# EAGLE design Sifteo Thundercracker Buddy Dev (EAGLE 5.11)
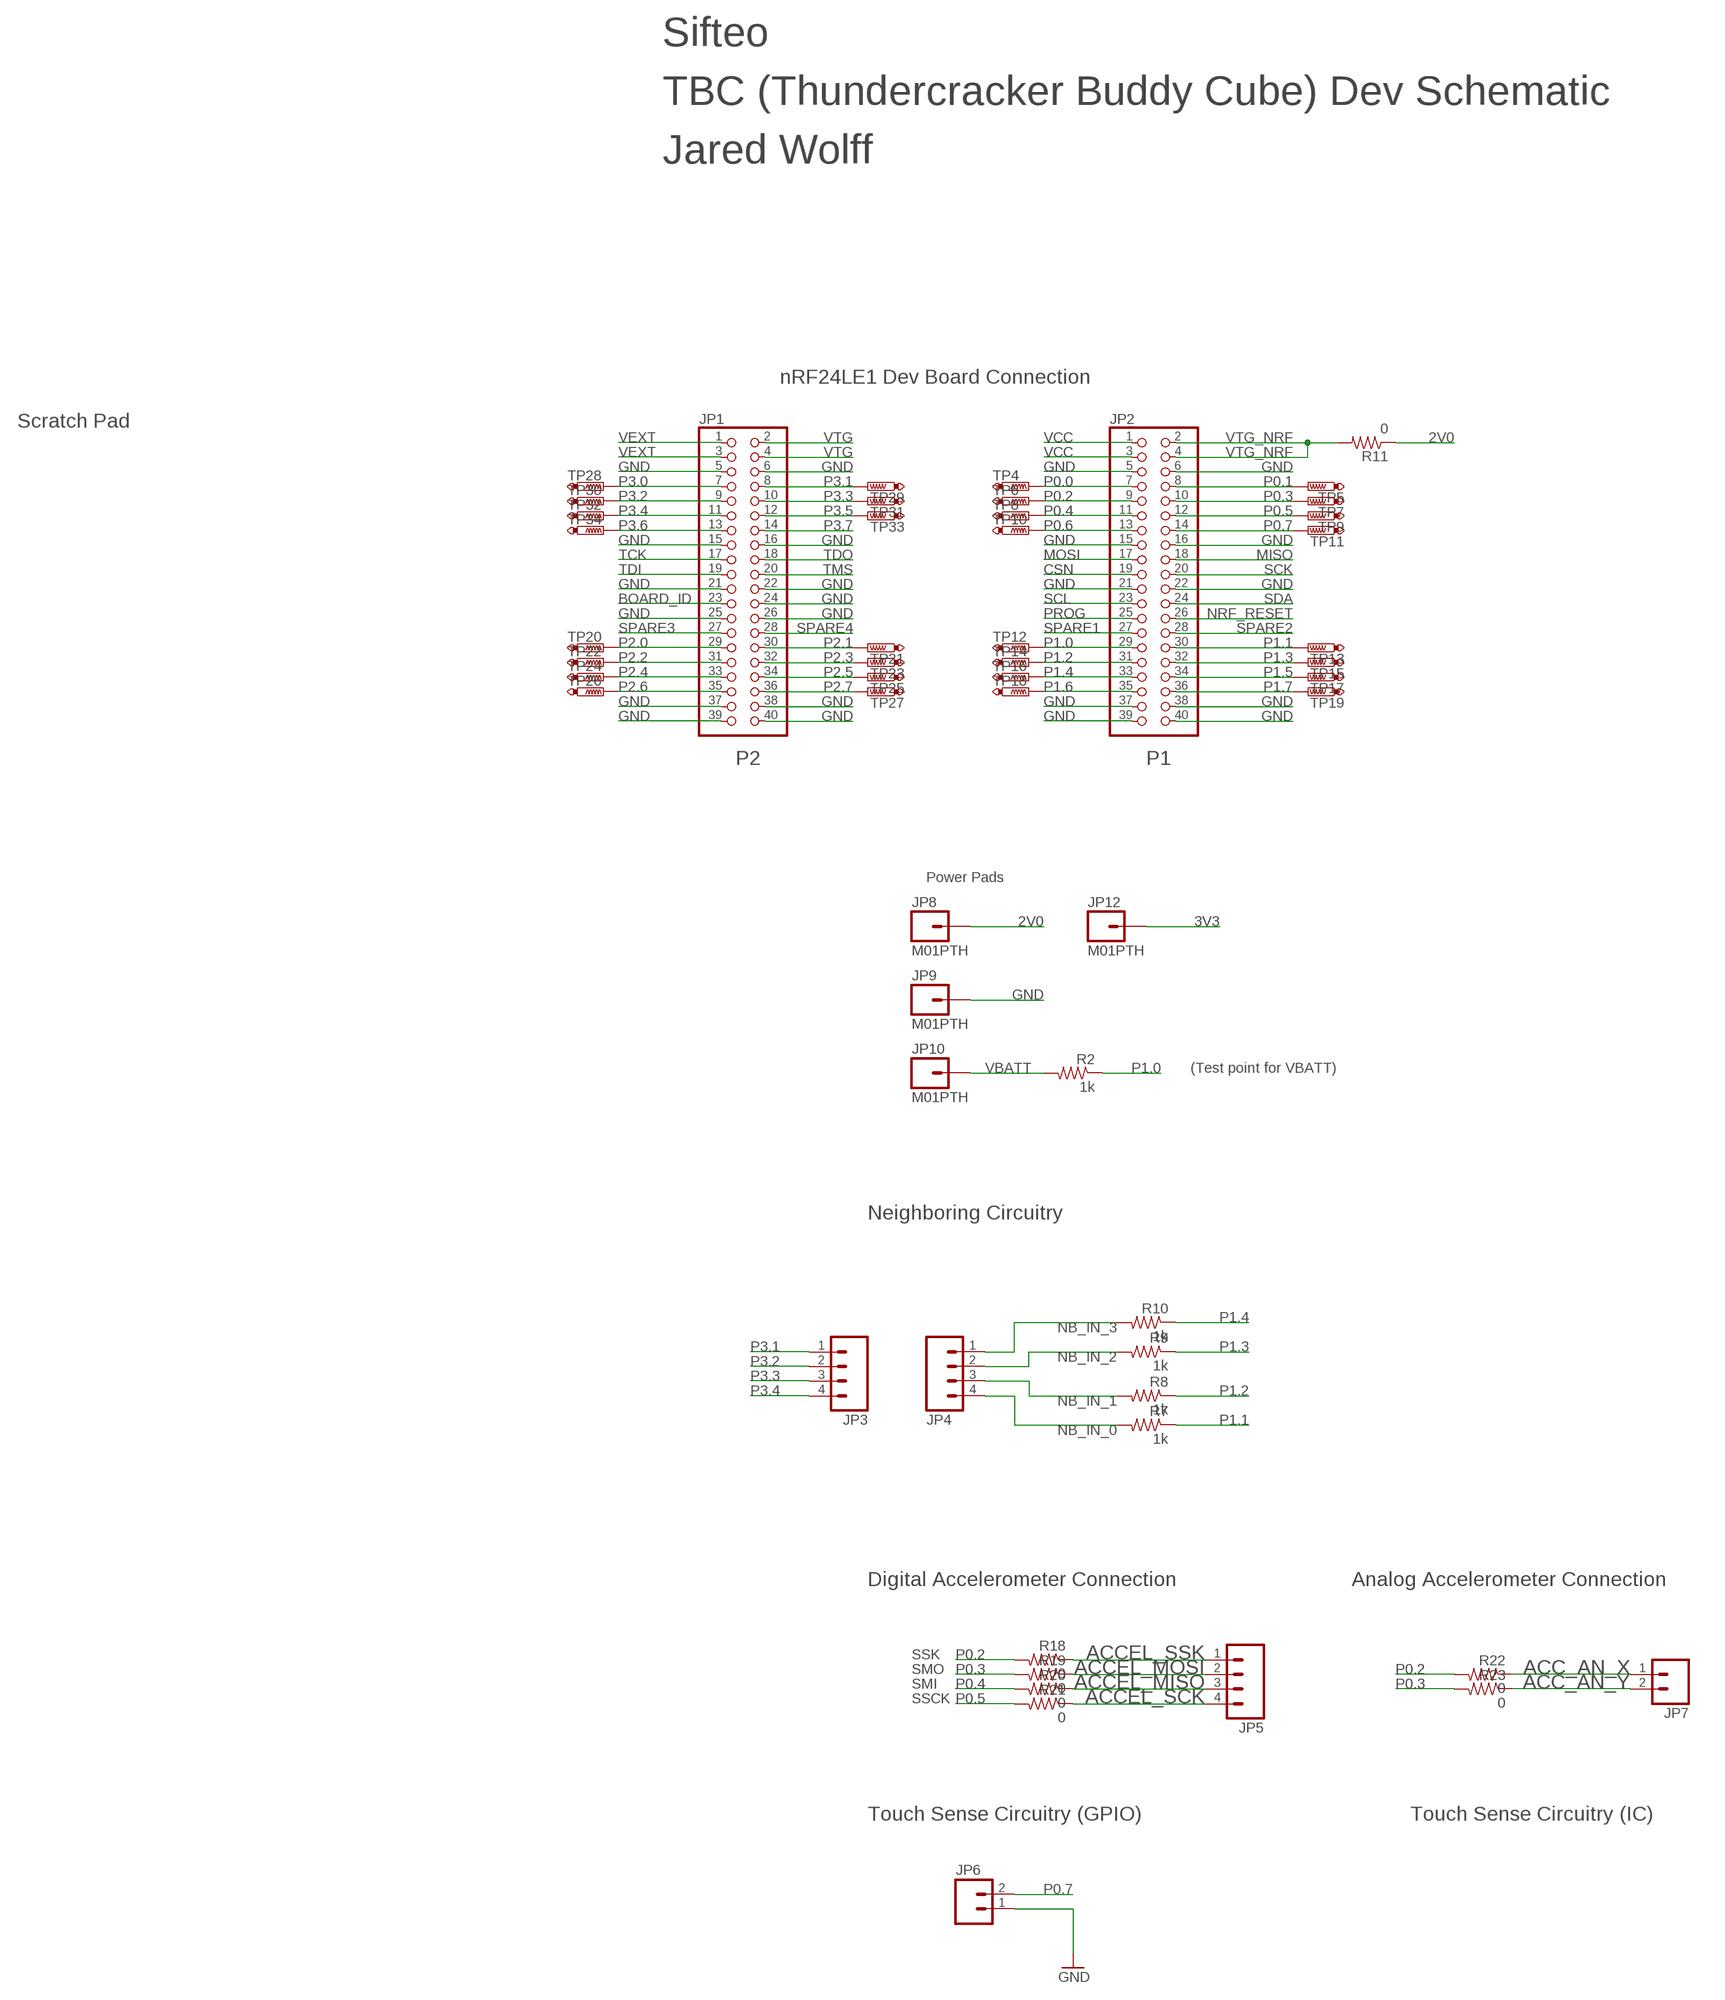
[diagram p0: schematic, sheet 1, part 1 of 2]
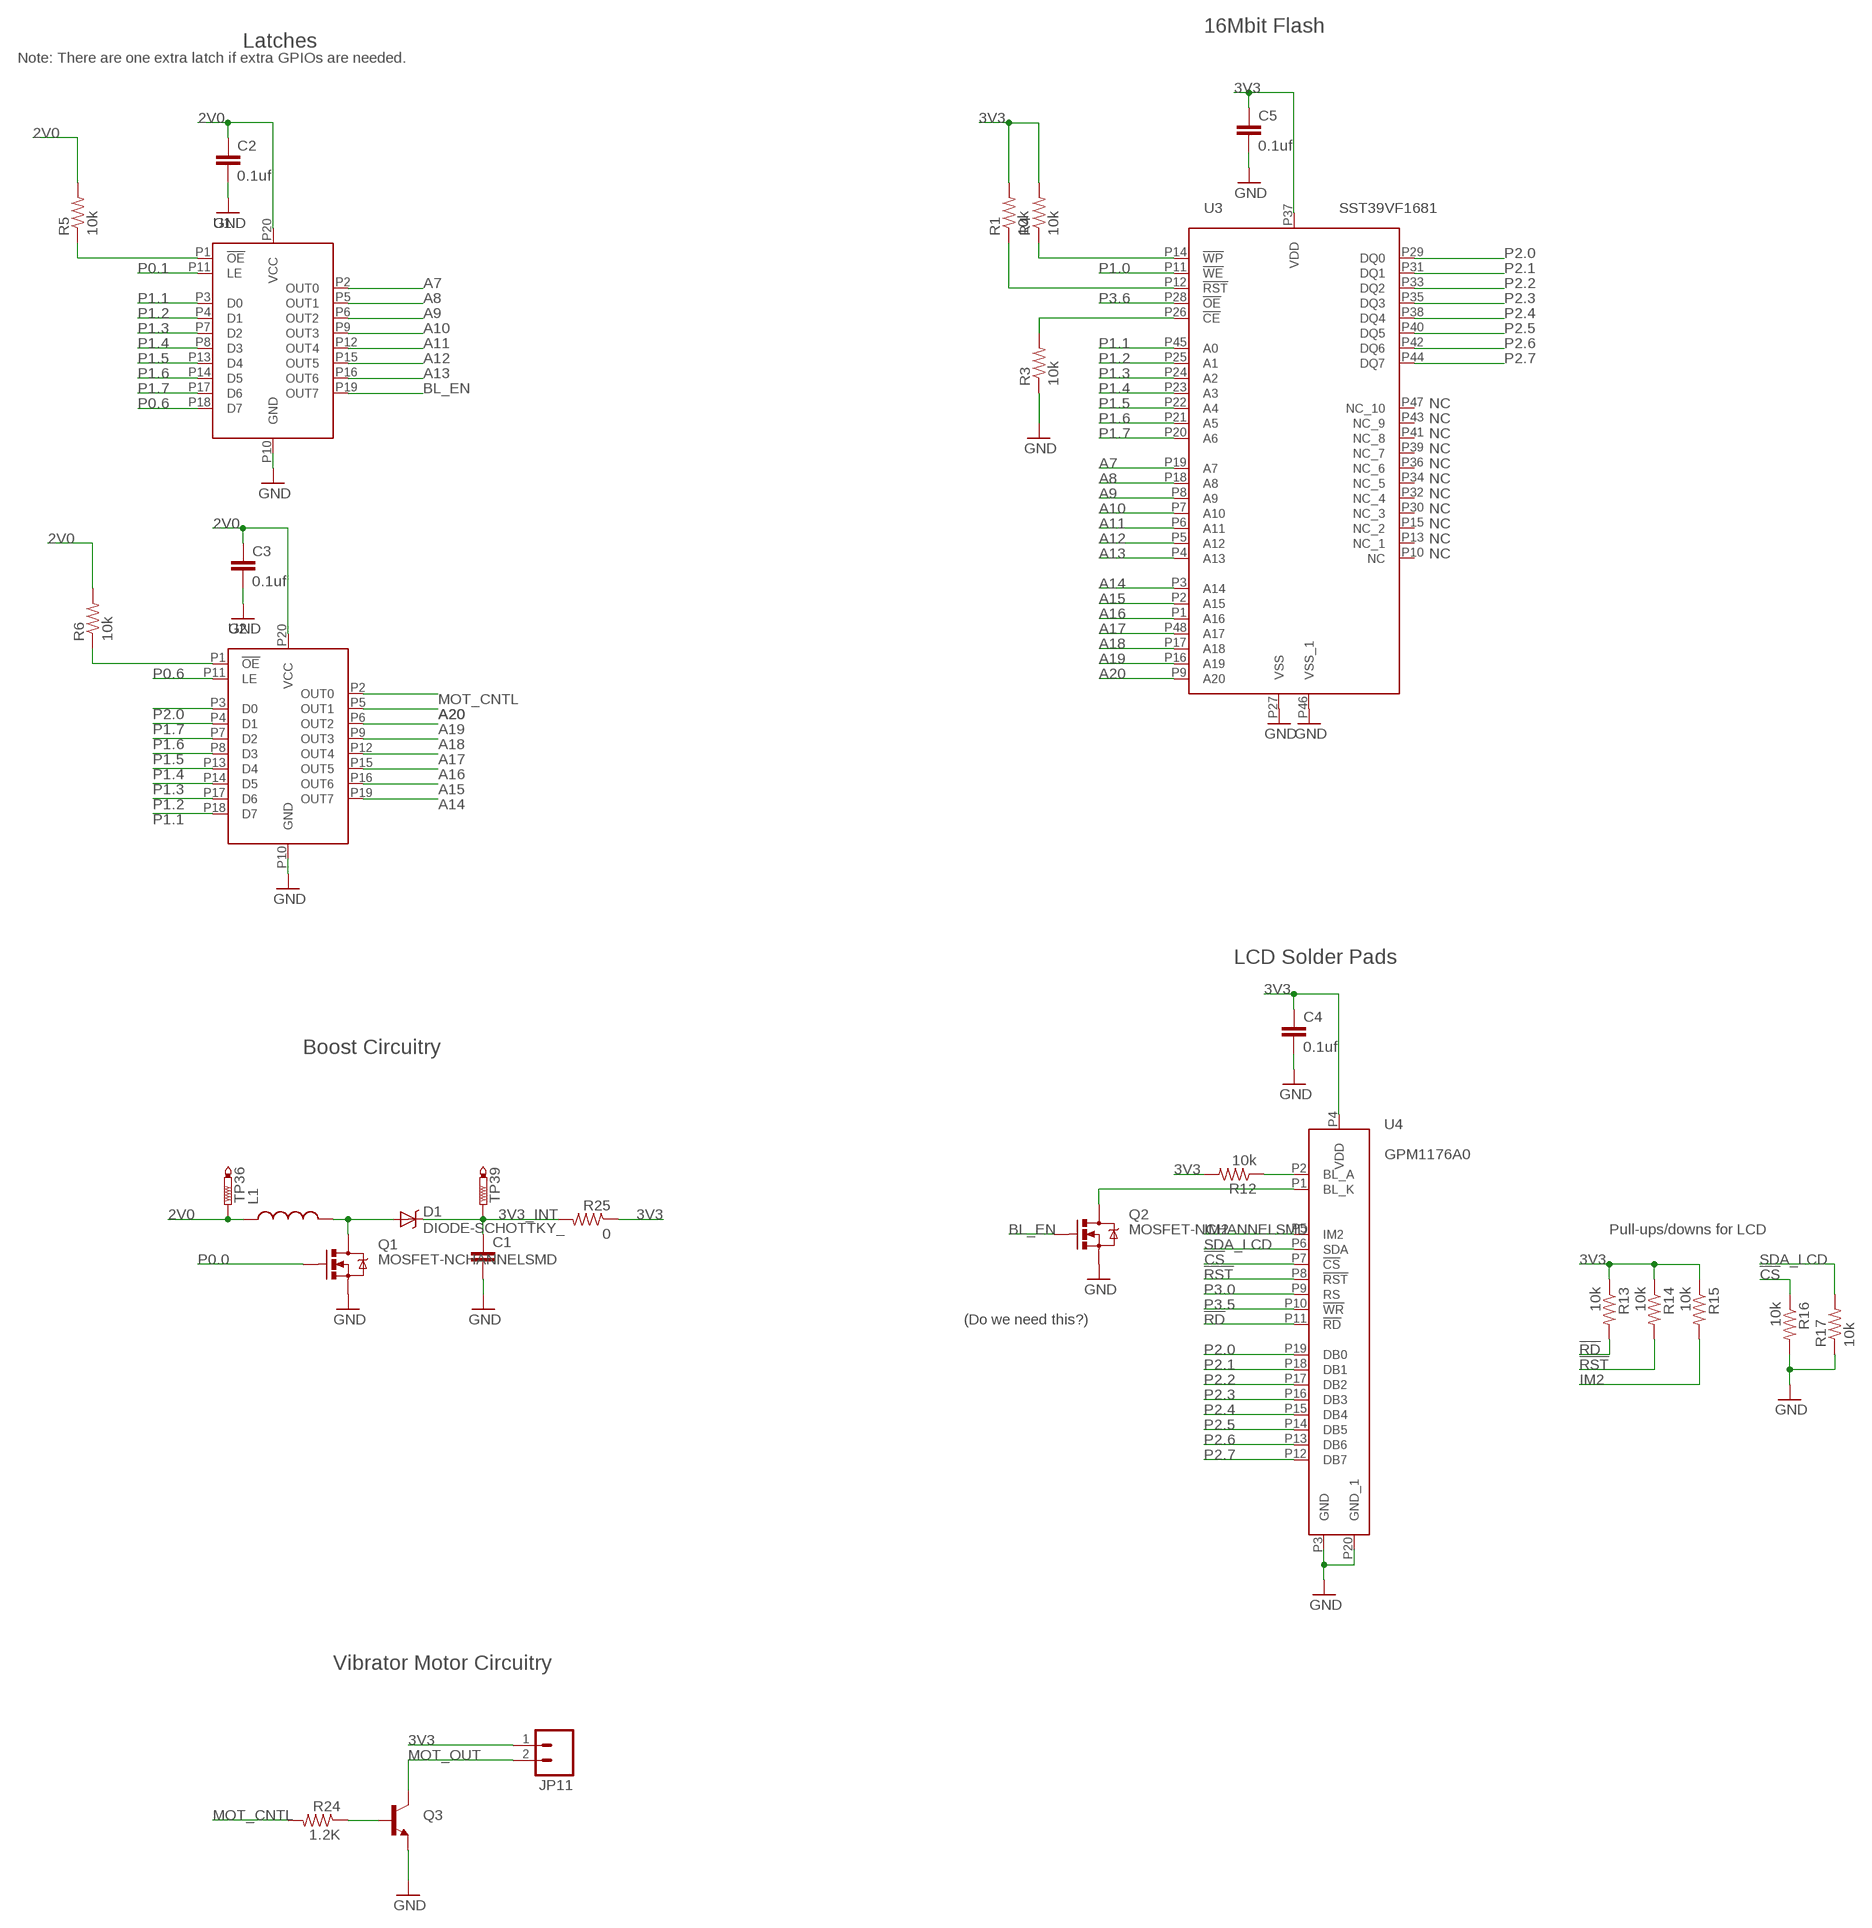
[diagram p1: schematic, sheet 1, part 2 of 2]

## Parts
C1  CAP0603-CAP  [0603-CAP]
C2  0.1uf  CAP0402-CAP  [0402-CAP]
C3  0.1uf  CAP0402-CAP  [0402-CAP]
C4  0.1uf  CAP0402-CAP  [0402-CAP]
C5  0.1uf  CAP0402-CAP  [0402-CAP]
D1  DIODE-SCHOTTKY_  [SMA-DIODE]
JP1  PINHD-2X20  [2X20]
JP2  PINHD-2X20  [2X20]
JP3  M04PTH  [1X04]
JP4  M04PTH  [1X04]
JP5  M04PTH  [1X04]
JP6  M02PTH  [1X02]
JP7  M02PTH  [1X02]
JP8  M01PTH  [1X01]
JP9  M01PTH  [1X01]
JP10  M01PTH  [1X01]
JP11  M02PTH  [1X02]
JP12  M01PTH  [1X01]
L1  INDUCTOR0805  [0805]
Q1  MOSFET-NCHANNELSMD  [SOT23-3]
Q2  MOSFET-NCHANNELSMD  [SOT23-3]
Q3  TRANSISTOR_NPNSOT23  [SOT23]
R1  10k  RESISTOR0603-RES  [0603-RES]
R2  1k  RESISTOR0603-RES  [0603-RES]
R3  10k  RESISTOR0603-RES  [0603-RES]
R4  10k  RESISTOR0603-RES  [0603-RES]
R5  10k  RESISTOR0603-RES  [0603-RES]
R6  10k  RESISTOR0603-RES  [0603-RES]
R7  1k  RESISTOR0603-RES  [0603-RES]
R8  1k  RESISTOR0603-RES  [0603-RES]
R9  1k  RESISTOR0603-RES  [0603-RES]
R10  1k  RESISTOR0603-RES  [0603-RES]
R11  0  RESISTOR0603-RES  [0603-RES]
R12  10k  RESISTOR0603-RES  [0603-RES]
R13  10k  RESISTOR0603-RES  [0603-RES]
R14  10k  RESISTOR0603-RES  [0603-RES]
R15  10k  RESISTOR0603-RES  [0603-RES]
R16  10k  RESISTOR0603-RES  [0603-RES]
R17  10k  RESISTOR0603-RES  [0603-RES]
R18  0  RESISTOR0603-RES  [0603-RES]
R19  0  RESISTOR0603-RES  [0603-RES]
R20  0  RESISTOR0603-RES  [0603-RES]
R21  0  RESISTOR0603-RES  [0603-RES]
R22  0  RESISTOR0603-RES  [0603-RES]
R23  0  RESISTOR0603-RES  [0603-RES]
R24  1.2K  RESISTOR0603-RES  [0603-RES]
R25  0  RESISTOR0603-RES  [0603-RES]
TP4  PTR1TP06R  [TP06R]
TP5  PTR1TP06R  [TP06R]
TP6  PTR1TP06R  [TP06R]
TP7  PTR1TP06R  [TP06R]
TP8  PTR1TP06R  [TP06R]
TP9  PTR1TP06R  [TP06R]
TP10  PTR1TP06R  [TP06R]
TP11  PTR1TP06R  [TP06R]
TP12  PTR1TP06R  [TP06R]
TP13  PTR1TP06R  [TP06R]
TP14  PTR1TP06R  [TP06R]
TP15  PTR1TP06R  [TP06R]
TP16  PTR1TP06R  [TP06R]
TP17  PTR1TP06R  [TP06R]
TP18  PTR1TP06R  [TP06R]
TP19  PTR1TP06R  [TP06R]
TP20  PTR1TP06R  [TP06R]
TP21  PTR1TP06R  [TP06R]
TP22  PTR1TP06R  [TP06R]
TP23  PTR1TP06R  [TP06R]
TP24  PTR1TP06R  [TP06R]
TP25  PTR1TP06R  [TP06R]
TP26  PTR1TP06R  [TP06R]
TP27  PTR1TP06R  [TP06R]
TP28  PTR1TP06R  [TP06R]
TP29  PTR1TP06R  [TP06R]
TP30  PTR1TP06R  [TP06R]
TP31  PTR1TP06R  [TP06R]
TP32  PTR1TP06R  [TP06R]
TP33  PTR1TP06R  [TP06R]
TP34  PTR1TP06R  [TP06R]
TP36  PTR1TP06R  [TP06R]
TP39  PTR1TP06R  [TP06R]
U1  74LCX373  [20-TSSOP-4.4MM]
U2  74LCX373  [20-TSSOP-4.4MM]
U3  SST39VF1681  [48-TSOP-12X20MM]
U4  GPM1176A0  [20-LCD-FLEX]

## Nets
2V0: C2.1 C3.1 JP8.1 L1.1 R5.2 R6.2 R11.1 TP36.TP U1.P20(VCC) U2.P20(VCC)
3V3: C4.1 C5.1 JP11.1 JP12.1 R1.2 R4.2 R12.2 R13.1 R14.1 R15.1 R25.1 U3.P37(VDD) U4.P4(VDD)
3V3_INT: C1.1 D1.C R25.2 TP39.TP
!CS: R16.1 U4.P7(!CS)
!RD: R13.2 U4.P11(!RD)
!RST: R14.2 U4.P8(!RST)
A7: U1.P2(OUT0) U3.P19(A7)
A8: U1.P5(OUT1) U3.P18(A8)
A9: U1.P6(OUT2) U3.P8(A9)
A10: U1.P9(OUT3) U3.P7(A10)
A11: U1.P12(OUT4) U3.P6(A11)
A12: U1.P15(OUT5) U3.P5(A12)
A13: U1.P16(OUT6) U3.P4(A13)
A14: U2.P19(OUT7) U3.P3(A14)
A15: U2.P16(OUT6) U3.P2(A15)
A16: U2.P15(OUT5) U3.P1(A16)
A17: U2.P12(OUT4) U3.P48(A17)
A18: U2.P9(OUT3) U3.P17(A18)
A19: U2.P6(OUT2) U3.P16(A19)
A20: U2.P5(OUT1) U3.P9(A20)
ACC_AN_X: JP7.1 R22.1
ACC_AN_Y: JP7.2 R23.1
ACCEL_MISO: JP5.3 R20.1
ACCEL_MOSI: JP5.2 R19.1
ACCEL_SCK: JP5.4 R21.1
ACCEL_SSK: JP5.1 R18.1
BL_EN: Q2.1(G) U1.P19(OUT7)
BOARD_ID: JP1.23
CSN: JP2.19
GND: C1.2 C2.2 C3.2 C4.2 C5.2 JP1.5 JP1.6 JP1.15 JP1.16 JP1.21 JP1.22 JP1.24 JP1.25 JP1.26 JP1.37 JP1.38 JP1.39 JP1.40 JP2.5 JP2.6 JP2.15 JP2.16 JP2.21 JP2.22 JP2.37 JP2.38 JP2.39 JP2.40 JP6.1 JP9.1 Q1.2(S) Q2.2(S) Q3.2(E) R3.1 R16.2 R17.1 U1.P10(GND) U2.P10(GND) U3.P27(VSS) U3.P46(VSS_1) U4.P3(GND) U4.P20(GND_1)
IM2: R15.2 U4.P5(IM2)
MISO: JP2.18
MOSI: JP2.17
MOT_CNTL: R24.2 U2.P2(OUT0)
MOT_OUT: JP11.2 Q3.3(C)
N$1: R1.1 U3.P12(!RST)
N$2: R3.2 U3.P26(!CE)
N$4: R4.1 U3.P14(!WP)
N$5: Q3.1(B) R24.1
N$6: R5.1 U1.P1(!OE)
N$7: Q2.3(D) U4.P1(BL_K)
N$9: R6.1 U2.P1(!OE)
N$10: D1.A L1.2 Q1.3(D)
N$11: R12.1 U4.P2(BL_A)
NB_IN_0: JP4.4 R7.2
NB_IN_1: JP4.3 R8.2
NB_IN_2: JP4.2 R9.2
NB_IN_3: JP4.1 R10.2
NRF_RESET: JP2.26
P0.0: JP2.7 Q1.1(G) TP4.TP
P0.1: JP2.8 TP5.TP U1.P11(LE)
P0.2: JP2.9 R18.2 R22.2 TP6.TP
P0.3: JP2.10 R19.2 R23.2 TP7.TP
P0.4: JP2.11 R20.2 TP8.TP
P0.5: JP2.12 R21.2 TP9.TP
P0.6: JP2.13 TP10.TP U1.P18(D7) U2.P11(LE)
P0.7: JP2.14 JP6.2 TP11.TP
P1.0: JP2.29 R2.1 TP12.TP U3.P11(!WE)
P1.1: JP2.30 R7.1 TP13.TP U1.P3(D0) U2.P18(D7) U3.P45(A0)
P1.2: JP2.31 R8.1 TP14.TP U1.P4(D1) U2.P17(D6) U3.P25(A1)
P1.3: JP2.32 R9.1 TP15.TP U1.P7(D2) U2.P14(D5) U3.P24(A2)
P1.4: JP2.33 R10.1 TP16.TP U1.P8(D3) U2.P13(D4) U3.P23(A3)
P1.5: JP2.34 TP17.TP U1.P13(D4) U2.P8(D3) U3.P22(A4)
P1.6: JP2.35 TP18.TP U1.P14(D5) U2.P7(D2) U3.P21(A5)
P1.7: JP2.36 TP19.TP U1.P17(D6) U2.P4(D1) U3.P20(A6)
P2.0: JP1.29 TP20.TP U2.P3(D0) U3.P29(DQ0) U4.P19(DB0)
P2.1: JP1.30 TP21.TP U3.P31(DQ1) U4.P18(DB1)
P2.2: JP1.31 TP22.TP U3.P33(DQ2) U4.P17(DB2)
P2.3: JP1.32 TP23.TP U3.P35(DQ3) U4.P16(DB3)
P2.4: JP1.33 TP24.TP U3.P38(DQ4) U4.P15(DB4)
P2.5: JP1.34 TP25.TP U3.P40(DQ5) U4.P14(DB5)
P2.6: JP1.35 TP26.TP U3.P42(DQ6) U4.P13(DB6)
P2.7: JP1.36 TP27.TP U3.P44(DQ7) U4.P12(DB7)
P3.0: JP1.7 TP28.TP U4.P9(RS)
P3.1: JP1.8 JP3.1 TP29.TP
P3.2: JP1.9 JP3.2 TP30.TP
P3.3: JP1.10 JP3.3 TP31.TP
P3.4: JP1.11 JP3.4 TP32.TP
P3.5: JP1.12 TP33.TP U4.P10(!WR)
P3.6: JP1.13 TP34.TP U3.P28(!OE)
P3.7: JP1.14
PROG: JP2.25
SCK: JP2.20
SCL: JP2.23
SDA: JP2.24
SDA_LCD: R17.2 U4.P6(SDA)
SPARE1: JP2.27
SPARE2: JP2.28
SPARE3: JP1.27
SPARE4: JP1.28
TCK: JP1.17
TDI: JP1.19
TDO: JP1.18
TMS: JP1.20
VBATT: JP10.1 R2.2
VCC: JP2.1 JP2.3
VEXT: JP1.1 JP1.3
VTG: JP1.2 JP1.4
VTG_NRF: JP2.2 JP2.4 R11.2
Unconnected: U3.P10(NC) U3.P13(NC_1) U3.P15(NC_2) U3.P30(NC_3) U3.P32(NC_4) U3.P34(NC_5) U3.P36(NC_6) U3.P39(NC_7) U3.P41(NC_8) U3.P43(NC_9) U3.P47(NC_10)

## Notes on the sheet
- Sifteo
- TBC (Thundercracker Buddy Cube) Dev Schematic
- Jared Wolff
- 16Mbit Flash
- Latches
- Note: There are one extra latch if extra GPIOs are needed.
- nRF24LE1 Dev Board Connection
- Scratch Pad
- NC
- NC
- NC
- NC
- NC
- NC
- NC
- NC
- NC
- NC
- NC
- P2 | P1
- Power Pads
- (Test point for VBATT)
- LCD Solder Pads
- Neighboring Circuitry | Boost Circuitry
- Pull-ups/downs for LCD
- (Do we need this?)
- Digital Accelerometer Connection | Analog Accelerometer Connection
- SSK
- SMO
- SMI
- SSCK
- Touch Sense Circuitry (GPIO) | Touch Sense Circuitry (IC) | Vibrator Motor Circuitry

## Library data of the parts
C1-C5 = SparkFun:CAP: Capacitor Standard 0603 ceramic capacitor, and 0.1" leaded capacitor.
D1 = SparkFun:DIODE-SCHOTTKY
JP1 JP2 = pinhead:PINHD-2X20: PIN HEADER
JP3-JP5 = SparkFun:M04: Header 4 Standard 4-pin 0.1" header. Use with straight break away headers (SKU : PRT-00116), right angle break away headers (PRT-00553), swiss pins (PRT-00743), machine pins (PRT-00117), and female headers (PRT-00115). Molex polarized connector foot print use with SKU : PRT-08231 with associated crimp pins and housings. 1MM SMD Version SKU: PRT-10208
JP6 JP7 JP11 = SparkFun:M02: Header 2 Standard 2-pin 0.1" header. Use with straight break away headers (SKU : PRT-00116), right angle break away headers (PRT-00553), swiss pins (PRT-00743), machine pins (PRT-00117), and female headers (PRT-00115). Molex polarized connector foot print use with SKU : PRT-08233 with associated crimp pins and housings.
JP8-JP10 JP12 = SparkFun:M01: Header 1 Standard 1-pin 0.1" header. Use with straight break away headers (SKU : PRT-00116), right angle break away headers (PRT-00553), swiss pins (PRT-00743), machine pins (PRT-00117), and female headers (PRT-00115).
L1 = SparkFun:INDUCTOR: Inductors Basic Inductor/Choke - 0603 and 1206. Footprints are not proven and vary greatly between part numbers.
Q1 Q2 = SparkFun:MOSFET-NCHANNEL
Q3 = SparkFun:TRANSISTOR_NPN: Transistor NPN BJT configuration in SOT23 package. MMBT2222 is the common NPN we use. Double check BCE configuration again layout.
R1-R25 = SparkFun:RESISTOR: Resistor Basic schematic elements and footprints for 0603, 1206, and PTH resistors.
TP4-TP34 TP36 TP39 = testpad:PTR1: TEST PIN
U1 U2 = Sifteo:74LCX373: All prices are in US dollars. Digi-Key Part Number 74LCX373MTCXCT-ND Price Break Unit Price Extended Price 1 0.70000 0.70 25 0.48920 12.23 100 0.41940 41.94 250 0.36224 90.56 500 0.31140 155.70 1,000 0.24149 241.49 Quantity Available 7,769 Note <http://ordering.digikey.com/Help.aspx?id=Quantity%20Available%20Note&site=US&lang=EN> Manufacturer Fairchild Semiconductor <http://digikey.com/Suppliers/us/Fairchild-Semiconductor.page?lang=EN> Manufacturer Part Number 74LCX373MTCX Description IC TRANSPARENT LATCH OCT 20TSSOP Lead Free Status / RoHS Status Lead free / RoHS Compliant Datasheets 74LCX373 <http://www.fairchildsemi.com/ds/74/74LCX373.pdf> Product Photos 20-TSSOP Pkg <http://media.digikey.com/photos/Fairchild%20Semi%20Photos/261-20-TSSOP.jpg> 20-TSSOP <http://media.digikey.com/Renders/~~Pkg.Case%20or%20Series/20-TSSOP%20(0.173,%204.40mm%20Width).jpg> Standard Package <http://dkc1.digikey.com/US/EN/help/help14.html> 1 Category Integrated Circuits (ICs) Family Logic - Latches Series 74LCX Logic Type D-Type Transparent Latch Circuit 8:8 Output Type Tri-State Voltage - Supply 2 V ~ 3.6 V Independent Circuits 1 Delay Time - Propagation 1.5ns Current - Output High, Low 24mA, 24mA Operating Temperature -40°C ~ 85°C Mounting Type Surface Mount Package / Case 20-TSSOP (0.173", 4.40mm Width) Supplier Device Package 20-TSSOP Packaging <http://dkc1.digikey.com/US/EN/help/help14.html> Cut Tape (CT) Catalog Page 1103 (US2011 Interactive) <http://onlinecatalog.digikey.com/?pagelabel=1103> 1103 (US2011 PDF) <http://dkc3.digikey.com/PDF/US2011/P1103.pdf> Other Names 74LCX373MTCXCT
U3 = Sifteo:SST39VF1681: All prices are in US dollars. Digi-Key Part Number SST39VF1681-70-4C-EKE-ND Price Break Unit Price Extended Price 1 3.56000 3.56 10 2.97000 29.70 25 2.82000 70.50 100 2.69000 269.00 Quantity Available 105 Manufacturer Microchip Technology <http://digikey.com/Suppliers/us/Microchip-Technology.page?lang=EN> Manufacturer Part Number SST39VF1681-70-4C-EKE Description IC FLASH MPF 16MBIT 70NS 48TSOP Lead Free Status / RoHS Status Lead free / RoHS Compliant Datasheets SST39 Series Brochure <http://ww1.microchip.com/downloads/en/DeviceDoc/01360A.pdf> SST39VF1681, 1682 <http://ww1.microchip.com/downloads/en/DeviceDoc/25040A.pdf> Product Photos 48-TSOP <http://media.digikey.com/Renders/Microchip%20Tech%20Renders/48-TSOP.jpg> Featured Product SST Serial and Parallel Flash Memory <http://www.digikey.com/product-highlights/us/en/microchip-sst-serial-parallel-flash-memory/4> Standard Package <http://dkc1.digikey.com/US/EN/help/help14.html> 96 Category Integrated Circuits (ICs) Family Memory Series - Format - Memory FLASH Memory Type FLASH Memory Size 16M (2M x 8) Speed 70ns Interface Parallel Voltage - Supply 2.7 V ~ 3.6 V Operating Temperature 0°C ~ 70°C Package / Case 48-TFSOP (0.472", 12.00mm Width) Supplier Device Package 48-TSOP Packaging <http://dkc1.digikey.com/US/EN/help/help14.html> Tray Catalog Page 1233 (US2011 Interactive) <http://onlinecatalog.digikey.com/?pagelabel=1233> 1233 (US2011 PDF) <http://dkc3.digikey.com/PDF/US2011/P1233.pdf>
U4 = Sifteo:GPM1176A0: Giantplus Technology GPM1176A0 1.52 Strip TFT LCD Module ROHS Compliant Description: The GPM1176A0 model is a Color TFT LCD supplied by Giantplus. This main Module has an 1.52 inch diagonally measured active display area with 128 X RGB X 128 resolution. Each pixel is divided into Red, Green and Blue sub-pixels and dots which are arranged in vertical stripes. LCD color is determined with Dithering 262K/65K/4K Color signal for each pixel. The GPM1176A0 has been designed to apply the interface method that enables low power, high speed, and high contrast. The GPM1176A0 is intended to support applications where thin thickness, wide viewing angle, low power are critical factors and graphic displays are important.

## Board
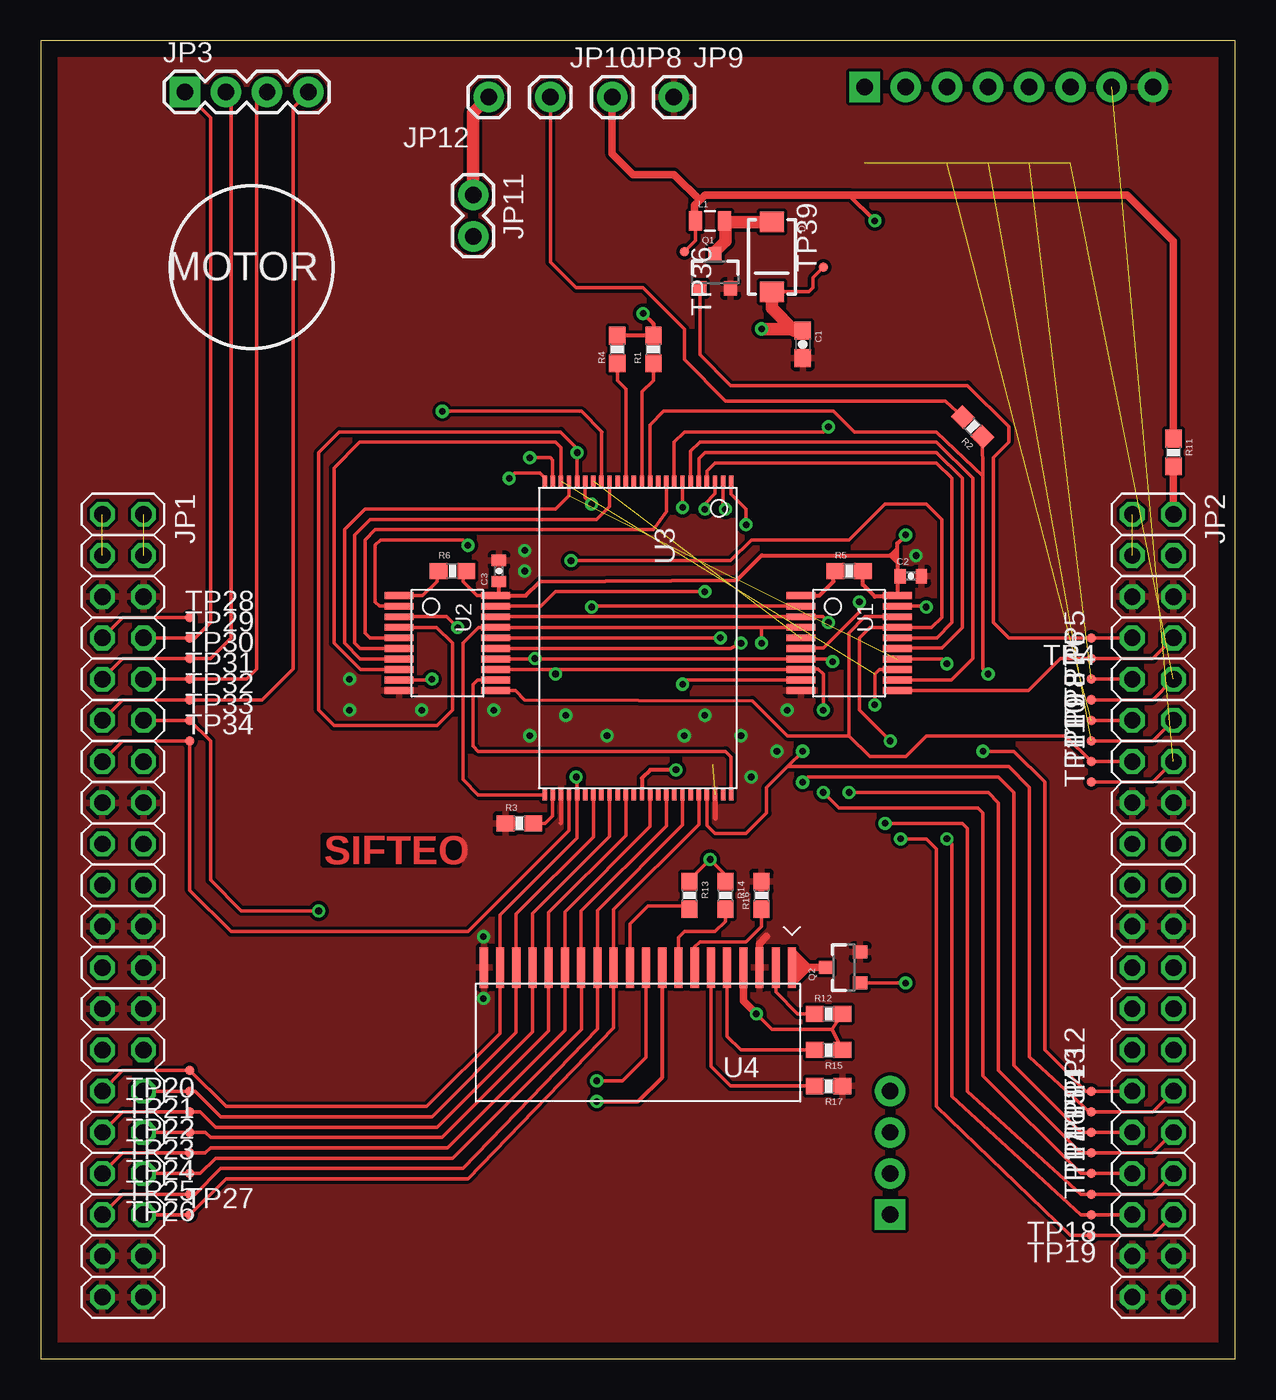
[diagram p2: board, top side]
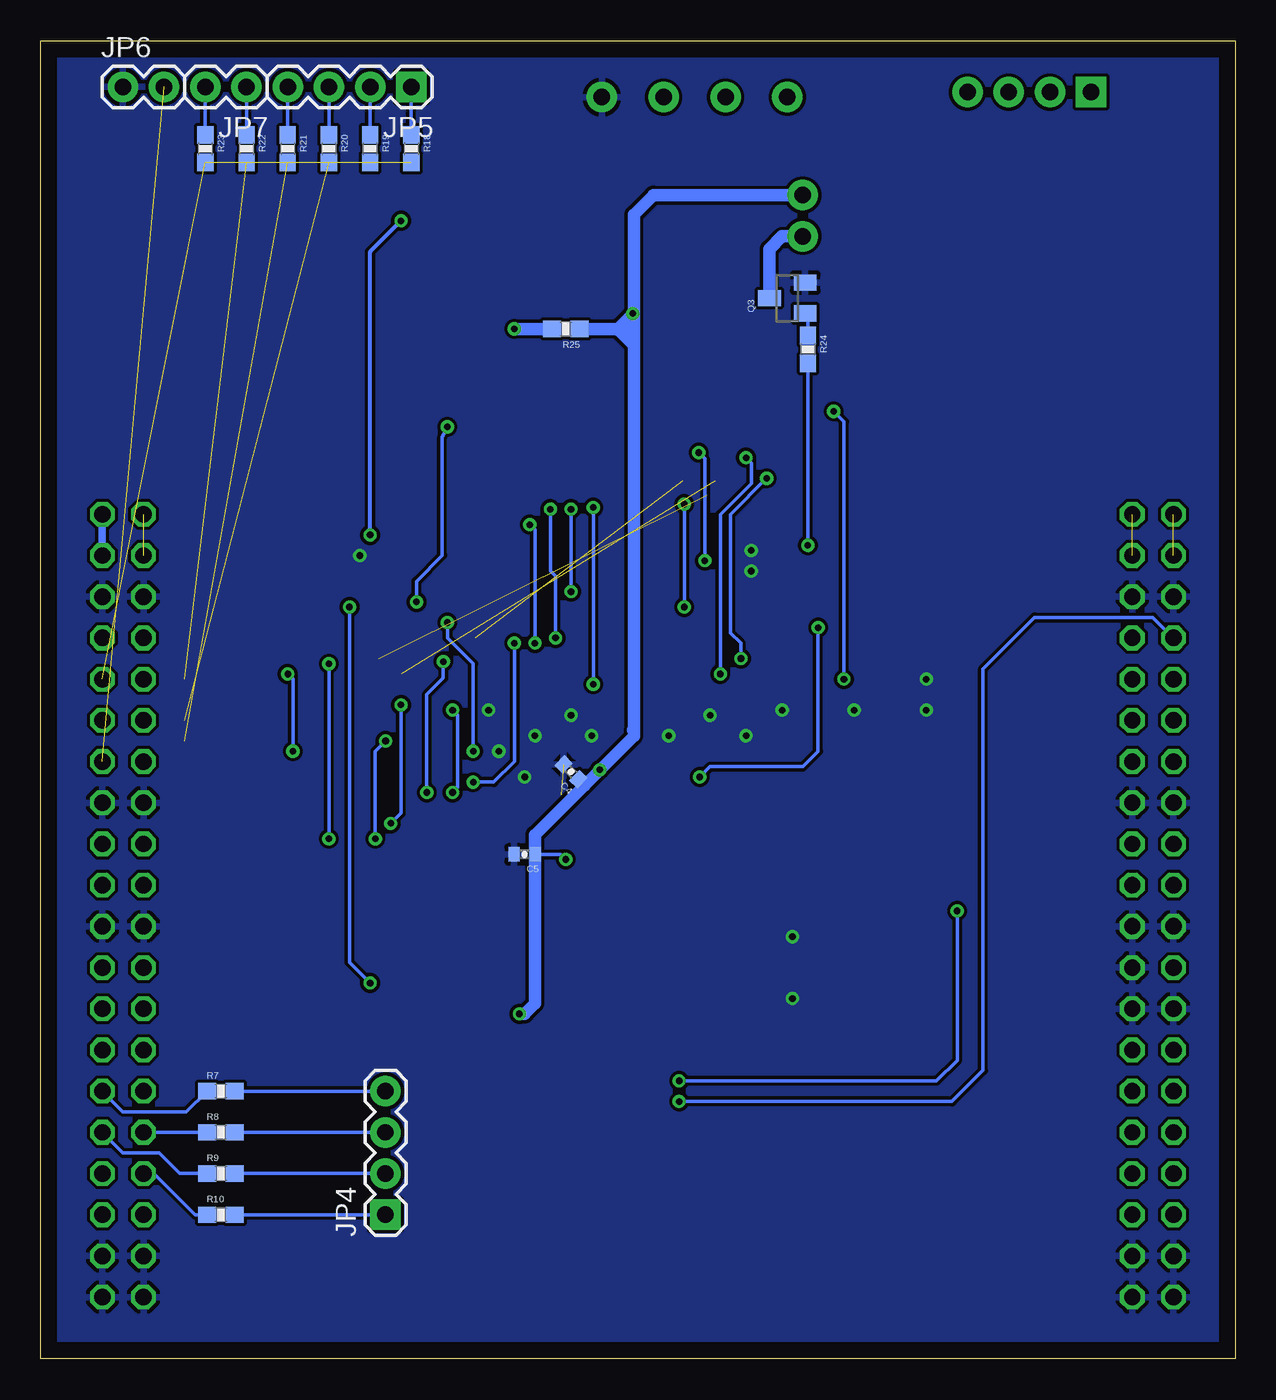
[diagram p3: board, bottom side, seen from below]

Size 73.66 x 81.28 mm. Coordinates in mm from the lower left corner, seen from the top.
Outline: 0,0 73.66,0 73.66,81.28 0,81.28 0,0
Copper layers (1*16): Top 0.035mm / dielectric 1.5mm / Bottom 0.035mm
Design rules "default *": minimum track width 8mil, minimum drill 16mil, track to track 8mil, track to pad 8mil, pad to pad 8mil, via to via 8mil, smd to smd 8mil, copper to edge 40mil, drill to drill 8mil, minimum pad ring 10mil, minimum via ring 8mil, stop-mask expansion 4mil, vias tented up to drill 0mil, thermal gap 10mil

### Footprints (pad centres in the part's own frame; a part is rotated, then mirrored left to right if it is on the bottom)
0603-CAP = smd 1.1 x 1: 1 -0.85,0; 2 0.85,0
0402-CAP = smd 0.7 x 0.9: 1 -0.65,0; 2 0.65,0
SMA-DIODE = smd 1.27 x 1.47: A -2.15,0; C 2.15,0
2X20 = drill 1.016 octagon: 1 -24.13,-1.27; 2 -24.13,1.27; 3 -21.59,-1.27; 4 -21.59,1.27; 5 -19.05,-1.27; 6 -19.05,1.27; 7 -16.51,-1.27; 8 -16.51,1.27; 9 -13.97,-1.27; 10 -13.97,1.27; 11 -11.43,-1.27; 12 -11.43,1.27; 13 -8.89,-1.27; 14 -8.89,1.27; 15 -6.35,-1.27; 16 -6.35,1.27; 17 -3.81,-1.27; 18 -3.81,1.27; 19 -1.27,-1.27; 20 -1.27,1.27; 21 1.27,-1.27; 22 1.27,1.27; 23 3.81,-1.27; 24 3.81,1.27; 25 6.35,-1.27; 26 6.35,1.27; 27 8.89,-1.27; 28 8.89,1.27; 29 11.43,-1.27; 30 11.43,1.27; 31 13.97,-1.27; 32 13.97,1.27; 33 16.51,-1.27; 34 16.51,1.27; 35 19.05,-1.27; 36 19.05,1.27; 37 21.59,-1.27; 38 21.59,1.27; 39 24.13,-1.27; 40 24.13,1.27
1X04 = drill 1.016 pad 1.88 square: 1 0,0 | drill 1.016 pad 1.88 round: 2 2.54,0; 3 5.08,0; 4 7.62,0
1X02 = drill 1.016 pad 1.88 round: 1 0,0; 2 2.54,0
1X01 = drill 1.016 pad 1.88 round: 1 0,0
0805 = smd 0.8 x 1.2: 1 -0.9,0; 2 0.9,0
SOT23-3 = smd 0.8 x 0.9: 1 -0.95,-1; 2 0.95,-1; 3 0,1.1
SOT23 = smd 1 x 1.4: 1 -0.95,-1.1; 2 0.95,-1.1; 3 0,1.1
0603-RES = smd 1.1 x 1: 1 -0.85,0; 2 0.85,0
TP06R = smd 0.6 x 0.6: TP 0,0
20-TSSOP-4.4MM = smd 0.42 x 1.78: P1 -2.925,-2.97; P2 -2.275,-2.97; P3 -1.625,-2.97; P4 -0.975,-2.97; P5 -0.325,-2.97; P6 0.325,-2.97; P7 0.975,-2.97; P8 1.625,-2.97; P9 2.275,-2.97; P10 2.925,-2.97; P11 2.925,2.97; P12 2.275,2.97; P13 1.625,2.97; P14 0.975,2.97; P15 0.325,2.97; P16 -0.325,2.97; P17 -0.975,2.97; P18 -1.625,2.97; P19 -2.275,2.97; P20 -2.925,2.97
48-TSOP-12X20MM = smd 0.7 x 0.27: P1 -9.675,5.75; P2 -9.675,5.25; P3 -9.675,4.75; P4 -9.675,4.25; P5 -9.675,3.75; P6 -9.675,3.25; P7 -9.675,2.75; P8 -9.675,2.25; P9 -9.675,1.75; P10 -9.675,1.25; P11 -9.675,0.75; P12 -9.675,0.25; P13 -9.675,-0.25; P14 -9.675,-0.75; P15 -9.675,-1.25; P16 -9.675,-1.75; P17 -9.675,-2.25; P18 -9.675,-2.75; P19 -9.675,-3.25; P20 -9.675,-3.75; P21 -9.675,-4.25; P22 -9.675,-4.75; P23 -9.675,-5.25; P24 -9.675,-5.75; P25 9.675,-5.75; P26 9.675,-5.25; P27 9.675,-4.75; P28 9.675,-4.25; P29 9.675,-3.75; P30 9.675,-3.25; P31 9.675,-2.75; P32 9.675,-2.25; P33 9.675,-1.75; P34 9.675,-1.25; P35 9.675,-0.75; P36 9.675,-0.25; P37 9.675,0.25; P38 9.675,0.75; P39 9.675,1.25; P40 9.675,1.75; P41 9.675,2.25; P42 9.675,2.75; P43 9.675,3.25; P44 9.675,3.75; P45 9.675,4.25; P46 9.675,4.75; P47 9.675,5.25; P48 9.675,5.75
20-LCD-FLEX = smd 0.5 x 2.5: P1 -9.5,0; P2 -8.5,0; P3 -7.5,0; P4 -6.5,0; P5 -5.5,0; P6 -4.5,0; P7 -3.5,0; P8 -2.5,0; P9 -1.5,0; P10 -0.5,0; P11 0.5,0; P12 1.5,0; P13 2.5,0; P14 3.5,0; P15 4.5,0; P16 5.5,0; P17 6.5,0; P18 7.5,0; P19 8.5,0; P20 9.5,0

### Placement (x,y rotation side)
C1  46.99,62.55 270 top
C2  53.66,48.26 0 top
C3  28.26,48.58 90 top
C4  40.96,36.2 135 bottom
C5  43.81,31.11 180 bottom
D1  45.09,67.94 270 top
JP1  5.08,27.94 270 top
JP2  68.58,27.94 270 top
JP3  8.89,78.11 0 top
JP4  52.39,8.89 90 bottom
JP5  50.8,78.42 180 bottom
JP6  68.58,78.42 0 bottom
JP7  60.96,78.42 180 bottom
JP8  35.24,77.79 0 top
JP9  39.05,77.79 0 top
JP10  31.43,77.79 0 top
JP11  26.67,71.75 270 top
JP12  27.62,77.79 180 top
L1  41.27,70.17 0 top
Q1  41.59,66.99 0 top
Q2  49.53,24.13 90 top
Q3  27.62,65.41 90 bottom
R1  37.78,62.23 90 top
R2  57.47,57.47 135 top
R3  29.53,33.02 0 top
R4  35.56,62.23 90 top
R5  49.85,48.58 0 top
R6  25.4,48.58 0 top
R7  62.55,16.51 0 bottom
R8  62.55,13.97 0 bottom
R9  62.55,11.43 0 bottom
R10  62.55,8.89 0 bottom
R11  69.85,55.88 270 top
R12  48.58,21.27 0 top
R13  40.01,28.57 270 top
R14  42.23,28.57 270 top
R15  48.58,19.05 180 top
R16  44.45,28.57 90 top
R17  48.58,16.83 180 top
R18  50.8,74.61 270 bottom
R19  53.34,74.61 270 bottom
R20  55.88,74.61 270 bottom
R21  58.42,74.61 270 bottom
R22  60.96,74.61 270 bottom
R23  63.5,74.61 270 bottom
R24  26.35,62.23 270 bottom
R25  41.27,63.5 180 bottom
TP4  64.77,44.45 180 top
TP5  64.77,43.18 90 top
TP6  64.77,41.91 90 top
TP7  64.77,40.64 90 top
TP8  64.77,39.37 90 top
TP9  64.77,38.1 90 top
TP10  64.77,36.83 90 top
TP11  64.77,35.56 90 top
TP12  64.77,16.51 90 top
TP13  64.77,15.24 90 top
TP14  64.77,13.97 90 top
TP15  64.77,12.7 90 top
TP16  64.77,11.43 90 top
TP17  64.77,10.16 90 top
TP18  64.77,8.89 180 top
TP19  64.77,7.62 180 top
TP20  9.21,17.78 180 top
TP21  9.21,16.51 180 top
TP22  9.21,15.24 180 top
TP23  9.21,13.97 180 top
TP24  9.21,12.7 180 top
TP25  9.21,11.43 180 top
TP26  9.21,10.16 180 top
TP27  9.21,8.89 0 top
TP28  9.21,45.72 0 top
TP29  9.21,44.45 0 top
TP30  9.21,43.18 0 top
TP31  9.21,41.91 0 top
TP32  9.21,40.64 0 top
TP33  9.21,39.37 0 top
TP34  9.21,38.1 0 top
TP36  39.69,68.26 270 top
TP39  48.26,67.31 90 top
U1  49.85,44.13 270 top
U2  25.08,44.13 270 top
U3  36.83,44.45 270 top
U4  36.83,24.13 180 top

### Tracks (layer width: path | path; a pad name or v marks a point on that pad's centre or on a via)
2V0  (via drill 0.41)
  Top 0.203: U2.P20 26.92,47.06 26.04,47.94 26.04,48.36 R6.2 | C2.1 53.01,48.13 52.82,47.94 | L1.1 40.38,68.95 TP36.TP
  Top 0.254: 52.39,49.53 44.45,49.53 42.93,48.01 30.8,47.94 29.91,47.06 U2.P20 28.26,47.26 C3.1 | 52.82,49.1 52.82,47.94 U1.P20 52.75,46.99 51.44,46.99 50.7,47.73 R5.2 | 52.39,49.53 52.82,49.1 | 52.82,49.1 52.82,50.28 v53.34,50.8 | v51.44,70.17 49.85,71.75 | 52.39,49.53 52.7,49.85 52.7,49.53 52.39,49.53
  Top 0.457: R11.1 69.85,68.9 66.99,71.75 49.85,71.75 40.96,71.75 40.64,71.44 | 40.64,71.44 40.32,71.12 40.32,70.22 L1.1 | JP8.1 35.24,74.3 36.51,73.03 39.05,73.03 40.64,71.44
  Bottom 0.254: v53.34,50.8 53.34,68.26 v51.44,70.17
3V3  (via drill 0.41)
  Top 0.203: R13.1 40.01,29.53 v41.27,30.8 42.23,29.84 R14.1 | v44.13,21.27 45.09,20.32 48.79,20.32 | 48.79,20.32 R12.2 | 48.79,20.32 R15.1
  Top 0.254: v39.18,36.32 37.59,36.32 37.08,35.81 U3.P37 | R4.2 R1.2 37.78,63.82 v37.15,64.45
  Top 0.457: U4.P4 43.33,22.07 v44.13,21.27
  Top 0.762: JP11.1 26.67,76.83 JP12.1
  Bottom 0.203: C4.1 | 40.13,35.37 C4.1 | 43.18,31.43 43.16,31.42 C5.1 41.59,31.11 v41.27,30.8
  Bottom 0.254: 37.08,70.55 37.08,64.52 v37.15,64.45
  Bottom 0.762: 37.08,38.73 37.08,38.42 v39.18,36.32 40.13,35.37 43.18,32.32 43.18,31.43 43.18,21.91 43.81,21.27 v44.13,21.27 | 37.08,38.73 37.08,70.55 35.88,71.75 JP11.1 | 37.08,38.73 37.13,38.79 | 38.1,63.5 R25.1 | v37.15,64.45 38.1,63.5 | 38.1,63.5 37.15,62.55 37.15,63.82 37.47,63.82 37.78,63.5 37.47,63.18
3V3_INT  (via drill 0.41)
  Top 0.203: D1.C 47.38,65.8 47.62,66.04 47.62,66.67 TP39.TP
  Top 0.762: C1.1 47.09,63.5 | C1.1 46.46,63.4 45.09,64.77 D1.C | v44.45,63.5 46.89,63.5 C1.1
  Bottom 0.762: R25.2 v44.45,63.5
!CS
  Top 0.203: R16.1 44.45,26.67 43.5,25.72 40.64,25.72 40.32,25.4 U4.P7
!RD
  Top 0.203: U4.P11 36.33,26.8 37.47,27.94 39.79,27.94 R13.2
!RST
  Top 0.203: U4.P8 39.33,26 39.69,26.35 41.59,26.35 42.23,26.99 R14.2
A7  (via drill 0.41)
  Top 0.203: U1.P2 34.02,46.41 v33.97,46.35 | U3.P19 33.58,53.1 v33.97,52.7
  Bottom 0.203: v33.97,46.35 v33.97,52.7
A8  (1 unrouted)
A9  (via drill 0.41)
  Top 0.203: v48.58,57.47 48.26,57.15 39.69,57.15 39.05,56.52 39.05,54.15 U3.P8 | v50.48,46.67 50.48,46.04 48.26,43.81 U1.P6
  Bottom 0.203: v50.48,46.67 50.48,47.94 48.9,49.53 48.9,56.83 v48.58,57.47
A10  (via drill 0.41)
  Top 0.203: v39.58,52.49 U3.P7 | U1.P9 39.63,41.86 v39.58,41.59
  Bottom 0.203: v39.58,41.59 v39.58,52.49
A11
  Top 0.203: U1.P12 56.15,41.86 57.47,43.18 57.47,54.29 55.24,56.52 40.64,56.52 40.08,55.95 U3.P6
A12
  Top 0.203: U1.P15 55.56,43.81 56.83,45.09 56.83,54.29 55.24,55.88 40.96,55.88 40.58,55.5 U3.P5
A13
  Top 0.203: U1.P16 55.25,44.46 56.2,45.4 56.2,54.29 55.24,55.24 41.59,55.24 41.08,54.73 U3.P4
A14  (via drill 0.41)
  Top 0.203: 41.59,54.11 U3.P3 41.58,53.35 41.59,53.34 40.96,52.7 v40.96,52.39 | U2.P19 30.85,46.41 31.75,47.31 v40.96,47.31
  Bottom 0.203: v40.96,47.31 v40.96,52.39
A15  (via drill 0.41)
  Top 0.203: U2.P16 v41.9,44.46 v41.91,44.45 | U3.P2 42.08,52.53 v42.23,52.39
  Bottom 0.203: v41.91,44.45 41.91,48.26 42.23,48.58 v42.23,52.39
A16  (via drill 0.41)
  Top 0.203: U2.P15 42.54,43.81 v43.18,44.13 | U3.P1 42.58,53.3 43.5,52.39 v43.5,51.44
  Bottom 0.203: v43.18,44.13 43.18,51.12 v43.5,51.44
A17
  Top 0.203: U2.P12 26.93,41.86 26.67,41.59 26.67,37.78 26.99,37.47 42.23,37.47 42.58,37.11 U3.P48
A18  (via drill 0.41)
  Top 0.203: U2.P9 24.08,41.86 v24.13,41.91 | v24.77,58.42 33.34,58.42 34.61,57.15 34.58,57.12 U3.P17
  Bottom 0.203: v24.13,41.91 24.13,57.78 v24.77,58.42
A19
  Top 0.203: U2.P6 19.69,43.81 19.37,44.13 19.37,50.8 20.32,51.75 34.29,51.75 35.08,52.55 35.08,52.87 U3.P16
A20
  Top 0.203: U2.P5 20.31,44.46 20,44.77 20,50.48 20.64,51.12 37.78,51.12 38.58,52.23 U3.P9
ACC_AN_X
  Bottom 0.203: R22.1 JP7.1
ACC_AN_Y
  Bottom 0.203: R23.1 JP7.2
ACCEL_MISO
  Bottom 0.203: R20.1 JP5.3
ACCEL_MOSI
  Bottom 0.203: R19.1 JP5.2
ACCEL_SCK
  Bottom 0.203: R21.1 JP5.4
ACCEL_SSK
  Bottom 0.203: R18.1 JP5.1
BL_EN  (via drill 0.41)
  Top 0.203: U1.P19 54.56,46.41 v54.61,46.35 | v53.34,23.18 Q2.1
  Bottom 0.203: v54.61,46.35 54.61,24.45 v53.34,23.18
GND  (via drill 0.41)  (1 unrouted)
  Top 0.254: U3.P27 32.08,33.03 32.07,33.02
  Top 0.305: U3.P46 41.58,33.35
  Top 0.457: U4.P3 44.33,25.6 44.77,26.04
  other vias: 43.81,35.88 45.4,37.47 46.04,40.01 27.94,40.01 30.16,38.42 32.38,39.69 34.92,38.42 39.69,38.42 40.96,39.69 23.5,40.01 19.05,40.01 19.05,41.91 43.18,38.42 53.98,49.53 29.84,49.85 29.84,48.58 27.3,22.23 27.3,26.04
  pour Bottom: 0,0 73.66,0 73.66,81.28 0,81.28
  pour Top: 0,0 0,81.28 73.66,81.28 73.66,0
IM2
  Top 0.203: U4.P5 42.33,19.9 43.18,19.05 R15.2
MOT_CNTL  (via drill 0.41)
  Top 0.203: U2.P2 20.9,46.41 20.64,46.67 20.64,50.16 20.95,50.48 26.04,50.48 v26.35,50.16
  Bottom 0.203: v26.35,50.16 R24.2
MOT_OUT
  Bottom 0.762: Q3.3 28.72,68.43 27.94,69.22 JP11.2
N$1
  Top 0.203: U3.P12 37.08,59.62 37.78,60.33 R1.1
N$2
  Top 0.203: U3.P26 31.58,33.48 31.11,33.02 R3.2
N$4
  Top 0.203: U3.P14 36.08,59.8 35.56,60.33 R4.1
N$5
  Bottom 0.203: R24.1 26.35,64.28 Q3.1
N$6
  Top 0.254: U1.P1 48.01,47.06 48.9,47.94 48.9,48.48 R5.1
N$7
  Top 0.457: 47.31,24.13 Q2.3 | 47.31,24.13 46.35,25.08 46.35,24.77 | 46.35,24.16 46.35,24.77 | U4.P1 46.35,24.16 | 47.31,24.13 46.35,23.18 46.35,24.16 | 46.35,24.77 46.99,24.13 46.67,23.81 46.67,24.13
N$9
  Top 0.203: U2.P1 23.56,47.06 24.45,47.94 24.45,48.48 R6.1
N$10
  Top 0.762: 45.16,70.17 D1.A 42.25,70.09 L1.2 42.23,70.11 42.23,68.9 41.59,68.26 Q1.3
N$11
  Top 0.203: R12.1 46.67,21.27 45.33,22.61 U4.P2
NB_IN_0
  Bottom 0.203: JP4.4 R7.2
NB_IN_1
  Bottom 0.203: JP4.3 R8.2
NB_IN_2
  Bottom 0.203: JP4.2 R9.2
NB_IN_3
  Bottom 0.203: JP4.1 R10.2
P0.0
  Top 0.203: JP2.7 TP4.TP 59.69,44.45 58.74,45.4 58.74,55.56 59.69,56.52 59.69,57.47 57.15,60.01 42.55,60.01 40.64,61.91 Q1.1
P0.1
  Top 0.203: JP2.8 68.58,43.18 TP5.TP 62.87,43.18 60.89,41.21 U1.P11
P0.2  (2 unrouted)
  Top 0.203: TP6.TP JP2.9
P0.3  (2 unrouted)
  Top 0.203: TP7.TP 68.58,40.64 JP2.10
P0.4  (1 unrouted)
  Top 0.203: TP8.TP JP2.11
P0.5  (1 unrouted)
  Top 0.203: TP9.TP 68.58,38.1 JP2.12
P0.6
  Top 0.203: U1.P18 50.84,45.76 49.85,44.77 49.85,38.42 | JP2.13 TP10.TP 63.18,38.42 54.61,38.42 53.34,37.15 51.12,37.15 49.85,38.42 | U2.P11 29.28,41.21 29.84,40.64 43.88,40.57 46.04,38.42 49.85,38.42
P0.7  (1 unrouted)
  Top 0.203: TP11.TP 68.58,35.56 JP2.14
P1.0  (via drill 0.41)
  Top 0.203: JP2.29 TP12.TP 64.45,16.51 61.91,19.05 61.91,35.56 60.01,37.47 v58.1,37.47 | U3.P11 37.58,57.58 38.42,58.42 48.9,58.42 50.16,57.15 55.24,57.15 58.1,54.43 | 58.1,54.43 R2.1 | v58.42,42.23 58.1,42.55 58.1,54.43
  Bottom 0.203: v58.1,37.47 58.1,41.91 v58.42,42.23
P1.1  (via drill 0.41)  (1 unrouted)
  Top 0.203: U2.P18 U1.P3 48.22,45.76 v48.58,45.4 | TP13.TP 68.58,15.24 JP2.30 | U3.P45 41.08,32.9 41.59,32.38 43.5,32.38 44.77,33.66 44.77,35.24 46.04,36.51 | 46.04,36.51 59.69,36.51 60.96,35.24 60.96,18.63 64.67,15.24 | 46.04,36.51 v46.99,37.47
  Bottom 0.203: 63.5,16.51 R7.1 64.67,15.24 TP13.TP 68.58,15.24 JP2.30 | v48.58,45.4 48.58,44.45 46.99,42.86 v46.99,37.47
P1.2  (via drill 0.41)
  Top 0.203: U3.P25 26.99,34.77 26.04,35.73 26.04,44.13 27.01,45.11 U2.P17 44.45,45.11 | 44.45,45.11 U1.P4 | JP2.31 TP14.TP 64.14,13.97 60.01,18.1 60.01,34.92 59.05,35.88 47.31,35.88 v46.99,35.56 | 44.45,45.11 v44.45,44.13
  Bottom 0.203: v46.99,35.56 45.72,35.56 44.45,36.83 v44.45,44.13 | JP2.31 R8.1
P1.3  (via drill 0.41)
  Top 0.203: U2.P14 30.8,43.16 | v30.48,43.18 30.77,43.18 30.8,43.16 | 30.8,43.16 U1.P7 48.66,43.16 v48.83,42.99 | v28.89,54.29 29.21,54.61 30.8,54.61 31.08,54.33 U3.P24 | JP2.32 68.58,12.7 TP15.TP 64.14,12.7 59.05,17.78 59.05,34.29 58.42,34.92 v49.85,34.92
  Bottom 0.203: v30.48,43.18 30.48,44.13 31.11,44.77 31.11,52.07 v28.89,54.29 | v49.85,34.92 49.85,40.96 48.83,41.97 v48.83,42.99 | R9.1 65.09,11.43 66.36,12.7 68.58,12.7 JP2.32
P1.4  (via drill 0.41)
  Top 0.203: 31.75,42.51 U2.P13 | 31.75,42.51 U1.P8 46.91,42.55 47.94,42.55 48.26,42.23 v48.26,40.01 | 31.75,42.51 v31.75,42.23 | U3.P23 31.58,55.41 31.43,55.56 v30.16,55.56 | JP2.33 TP16.TP 64.14,11.43 58.1,17.46 58.1,33.66 57.78,33.97 49.21,33.97 v48.26,34.92
  Bottom 0.203: v31.75,42.23 31.75,52.07 29.84,53.98 29.84,55.24 v30.16,55.56 | v48.26,40.01 47.94,39.69 47.94,35.24 v48.26,34.92 | R10.1 64.14,8.89 66.67,11.43 JP2.33
P1.5  (via drill 0.41)  (1 unrouted)
  Top 0.203: U2.P8 19.72,42.51 18.1,44.13 18.1,54.93 19.68,56.52 31.75,56.52 32.08,56.19 U3.P22 | JP2.34 68.58,10.16 TP17.TP 64.14,10.16 57.15,16.51 57.15,32.7 56.83,33.02 v52.07,33.02 | v51.44,40.32 51.44,42.23 51.72,42.51 U1.P13
  Bottom 0.203: 51.12,40.32 v51.44,40.32 51.44,33.66 v52.07,33.02
P1.6  (via drill 0.41)  (1 unrouted)
  Top 0.203: U2.P7 19.71,43.16 18.73,44.13 18.73,51.12 20,52.39 31.75,52.39 32.58,53.22 U3.P21 | JP2.35 TP18.TP 64.14,8.89 56.2,16.19 56.2,31.75 v55.88,32.07 | U1.P14 55.59,43.16 v55.88,42.86
  Bottom 0.203: v55.88,32.07 v55.88,42.86
P1.7  (via drill 0.41)
  Top 0.203: U2.P4 24.43,45.11 25.4,44.13 25.4,40.01 24.45,39.05 18.1,39.05 17.14,40.01 17.14,55.88 18.41,57.15 32.07,57.15 33.08,56.14 v33.08,55.88 U3.P20 | JP2.36 68.58,7.62 TP19.TP 63.5,7.62 55.24,15.56 55.24,31.43 54.61,32.07 v53.02,32.07 | v32.7,49.21 42.55,49.21 43.81,50.48 49.85,50.48 52.07,52.7 54.61,52.7 55.56,51.75 55.56,45.72 54.93,45.09 | U1.P17 54.91,45.11 54.93,45.09 | 54.93,45.09 51.12,45.09 50.48,44.45 50.48,40.01 v52.39,38.1
  Bottom 0.203: v53.02,32.07 53.02,37.47 v52.39,38.1 | v32.7,49.21 32.7,55.5 v33.08,55.88
P2.0  (via drill 0.41)
  Top 0.203: JP1.29 5.08,17.78 TP20.TP 11.43,15.56 23.81,15.56 28.33,20.07 U4.P19 28.33,27.38 33.08,32.13 U3.P29 33.08,35.82 | U2.P3 25.05,45.76 v25.72,45.09
  Top 0.254: 33.08,35.82 v33.02,35.88
  Bottom 0.203: v25.72,45.09 25.72,37.47 26.67,36.51 32.38,36.51 v33.02,35.88
P2.1
  Top 0.203: JP1.30 TP21.TP 9.53,16.51 11.11,14.92 24.13,14.92 29.33,20.12 U4.P18 29.33,27.43 34.08,32.17 U3.P31
P2.2
  Top 0.203: JP1.31 5.08,15.24 TP22.TP 9.84,15.24 10.79,14.29 24.45,14.29 30.33,20.17 U4.P17 30.33,27.47 35.08,32.22 U3.P33
P2.3
  Top 0.203: JP1.32 TP23.TP 10.16,13.97 10.48,13.65 24.77,13.65 31.33,20.22 U4.P16 31.33,27.52 36.08,32.27 U3.P35
P2.4
  Top 0.203: JP1.33 5.08,12.7 TP24.TP 10.16,12.7 10.48,13.02 25.08,13.02 32.33,20.27 U4.P15 32.33,27.57 37.58,32.82 U3.P38
P2.5
  Top 0.203: JP1.34 TP25.TP 9.84,11.43 10.79,12.38 25.4,12.38 33.34,20.32 U4.P14 33.33,27.61 38.58,32.87 U3.P40
P2.6
  Top 0.203: JP1.35 5.08,10.16 TP26.TP 9.53,10.16 11.11,11.75 26.04,11.75 34.33,20.36 U4.P13 34.33,27.66 39.58,32.91 U3.P42
P2.7
  Top 0.203: JP1.36 TP27.TP 11.43,11.11 26.35,11.11 35.33,20.41 U4.P12 35.33,27.71 40.58,32.96 U3.P44
P3.0  (via drill 0.41)
  Top 0.203: JP1.7 5.08,45.72 TP28.TP
  Top 0.254: v34.29,15.88 36.83,15.88 38.33,17.38 U4.P9
  Bottom 0.203: v34.29,15.88 17.46,15.88 15.56,17.78 15.56,42.55 12.38,45.72 5.08,45.72 JP1.7
P3.1
  Top 0.203: JP1.8 TP29.TP 9.53,44.45 10.48,45.4 10.48,76.52 JP3.1
P3.2
  Top 0.203: JP1.9 5.08,43.18 TP30.TP 10.48,43.18 11.75,44.45 11.75,77.79 JP3.2
P3.3
  Top 0.203: JP1.10 TP31.TP 12.7,41.91 13.34,42.55 13.34,77.47 JP3.3
P3.4
  Top 0.203: JP1.11 5.08,40.64 TP32.TP 13.65,40.64 15.56,42.55 15.56,77.15 JP3.4
P3.5  (via drill 0.41)
  Top 0.203: U4.P10 37.33,18.6 35.88,17.14 v34.29,17.14 | JP1.12 TP33.TP 10.48,38.1 10.48,29.53 12.38,27.62 v17.14,27.62
  Bottom 0.203: v34.29,17.14 18.41,17.14 17.14,18.41 v17.14,27.62
P3.6
  Top 0.203: U3.P28 32.58,32.58 26.35,26.35 11.75,26.35 9.21,28.89 TP34.TP 5.08,38.1 JP1.13
SDA_LCD
  Top 0.203: U4.P6 41.33,18.04 42.55,16.83 R17.2
VBATT
  Top 0.203: JP10.1 31.43,67.63 33.02,66.04 37.15,66.04 39.69,63.5 39.69,61.59 42.23,59.05 55.78,59.05 R2.2
VCC  (1 unrouted)
VEXT  (1 unrouted)
VTG  (1 unrouted)
VTG_NRF
  Top 0.457: JP2.2 R11.2
  Bottom 0.457: JP2.4 JP2.2

### Text on the board
Top: SIFTEO
tPlace: MOTOR